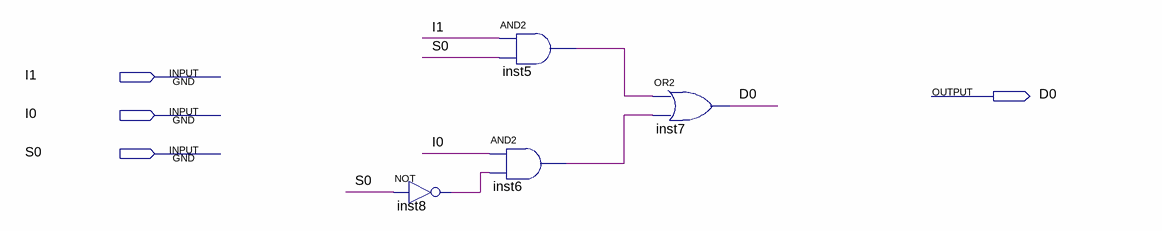
[diagram p0: schematic sheet]
// Quartus schematic mx2x1.bdf as structural Verilog: 4 symbols, 4 pins
module mx2x1 (
  input  I1,
  input  I0,
  input  S0,
  output D0
);

  wire inst5_out, inst6_out, inst8_out;

  not inst8 (inst8_out, S0);
  and inst6 (inst6_out, I0, inst8_out);
  and inst5 (inst5_out, I1, S0);
  or inst7 (D0, inst5_out, inst6_out);
endmodule
